# EAGLE schematic protractor (EAGLE 7.5.0)
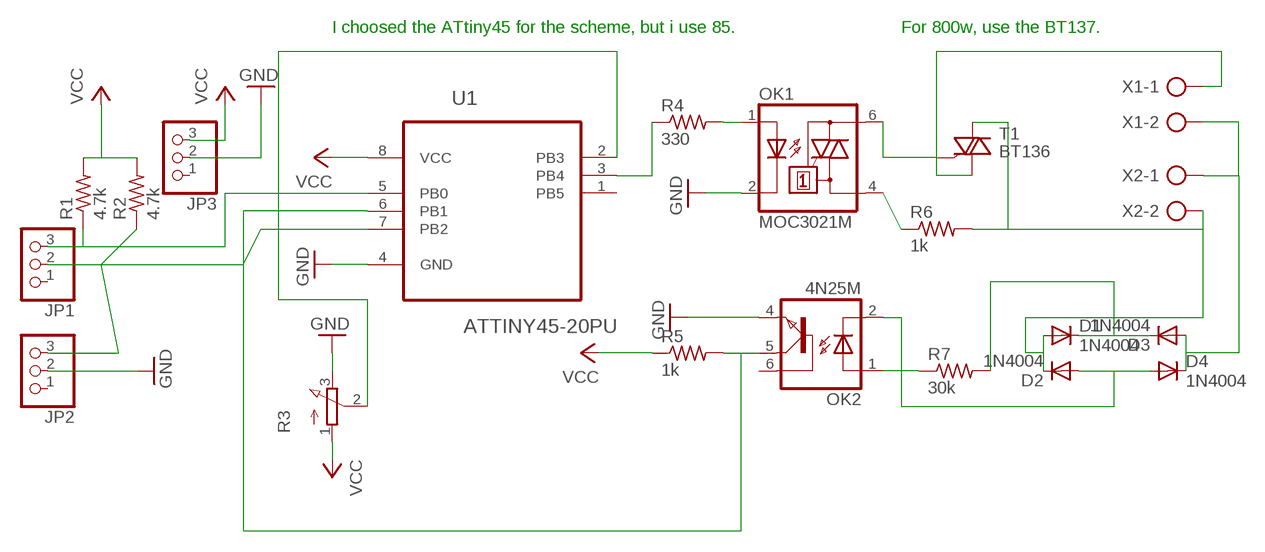
[diagram p0: schematic, sheet 1]

## Parts
D1  1N4004  [DO41-10]
D2  1N4004  [DO41-10]
D3  1N4004  [DO41-10]
D4  1N4004  [DO41-10]
JP1  PINHD-1X3  [1X03]
JP2  PINHD-1X3  [1X03]
JP3  PINHD-1X3  [1X03]
OK1  MOC3021M  [DIL06]
OK2  4N25M  [DIL06]
R1  4.7k  R-US_0207/12  [0207/12]
R2  4.7k  R-US_0207/12  [0207/12]
R3  3RP/1610N  [3RP/1610N]
R4  330  R-US_0207/12  [0207/12]
R5  1k  R-US_0207/12  [0207/12]
R6  1k  R-US_0207/12  [0207/12]
R7  30k  R-US_0207/12  [0207/12]
T1  BT136  [TO220AB]
U1  ATTINY45-20PU  [DIP254P762X533-8]
X1  AK500/2-H  [AK500/2-H]
X2  AK500/2-H  [AK500/2-H]

## Nets
GND: JP2.2 JP3.2 OK1.2(C) OK2.4(EMI) R3.3(E) U1.4(GND)
N$1: D2.A D4.A OK2.2(C)
N$2: D1.C D3.C R7.2
N$3: D3.A D4.C X1.2 X2.1
N$4: D1.A D2.C R6.2 T1.2(A2) X2.2
N$5: OK2.1(A) R7.1
N$6: OK1.6(A2) T1.3(G)
N$7: OK1.4(A1) R6.1
N$8: T1.1(A1) X1.1
N$9: R3.2(S) U1.2(PB3)
N$10: OK2.5(COL) R5.2 U1.6(PB1)
N$11: JP1.3 R1.1 U1.5(PB0)
N$12: R4.1 U1.3(PB4)
N$13: OK1.1(A) R4.2
N$14: JP1.2 JP2.3 R2.1 U1.7(PB2)
VCC: JP3.3 R1.2 R2.2 R3.1(A) R5.1 U1.8(VCC)
Unconnected: JP1.1 JP2.1 JP3.1 OK2.6(BAS) U1.1(PB5)

## Notes on the sheet
- I choosed the ATtiny45 for the scheme, but i use 85. | For 800w, use the BT137.

## Library data of the parts
D1-D4 = adafruit:1N4004: DIODE General purpose 1N400x type rectifier (With bigger pads) http://www.ladyada.net/library/pcb/eaglelibrary.html
JP1-JP3 = adafruit:PINHD-1X3: PIN HEADER
OK1 = optocoupler:MOC30*M: RANDOM-PHASE OPTOISOLATORS TRIAC DRIVER OUTPUT Source: http://www.fairchildsemi.com MOC3020-M.pdf; MF: FAIRCHILD SEMICONDUCTOR; MPN: MOC3021-M; OC_FARNELL: 1021365; OC_NEWARK: 95B7895
OK2 = optocoupler:4N*?M: General Purpose 6-Pin Phototransistor Optocouplers Source: http://www.fairchildsemi.com/ds/4N/4N35-M.pdf; MPN: 4N25-M; OC_FARNELL: 1021349; OC_NEWARK: 98K9084
R1 R2 R4-R7 = adafruit:R-US_: RESISTOR, American symbol
R3 = pot:3RP/1610N: 16mm Potentiometer one level Source: http://www.alphapotentiometers.net/html/16mm_pot_2.html
T1 = triac:BT136: Triac BT136 series E sensitive gate Source: http://www.nxp.com/acrobat_download/datasheets/BT136_SERIES_E_2.pdf
U1 = Atmel_By_element14_Batch_1-00:ATTINY45-20PU: 8-bit Microcontroller with 2/4/8KBytes In-System Programmable Flash; MPN: ATTINY45-20PU; OC_FARNELL: 1288352; OC_NEWARK: 23M5072; PACKAGE: PDIP-8; SUPPLIER: Atmel
X1 X2 = con-ptr500:AK500/2-H: CONNECTOR Aug. 2004 / PTR Meßtechnik: Die Bezeichnung der Serie AK505 wurde geändert. Es handelt sich hierbei um AK500 in horizontaler Ausführung.; OC_FARNELL: unknown; OC_NEWARK: unknown